# EAGLE design watch_v1_test_Rev01 (EAGLE 9.6.2)
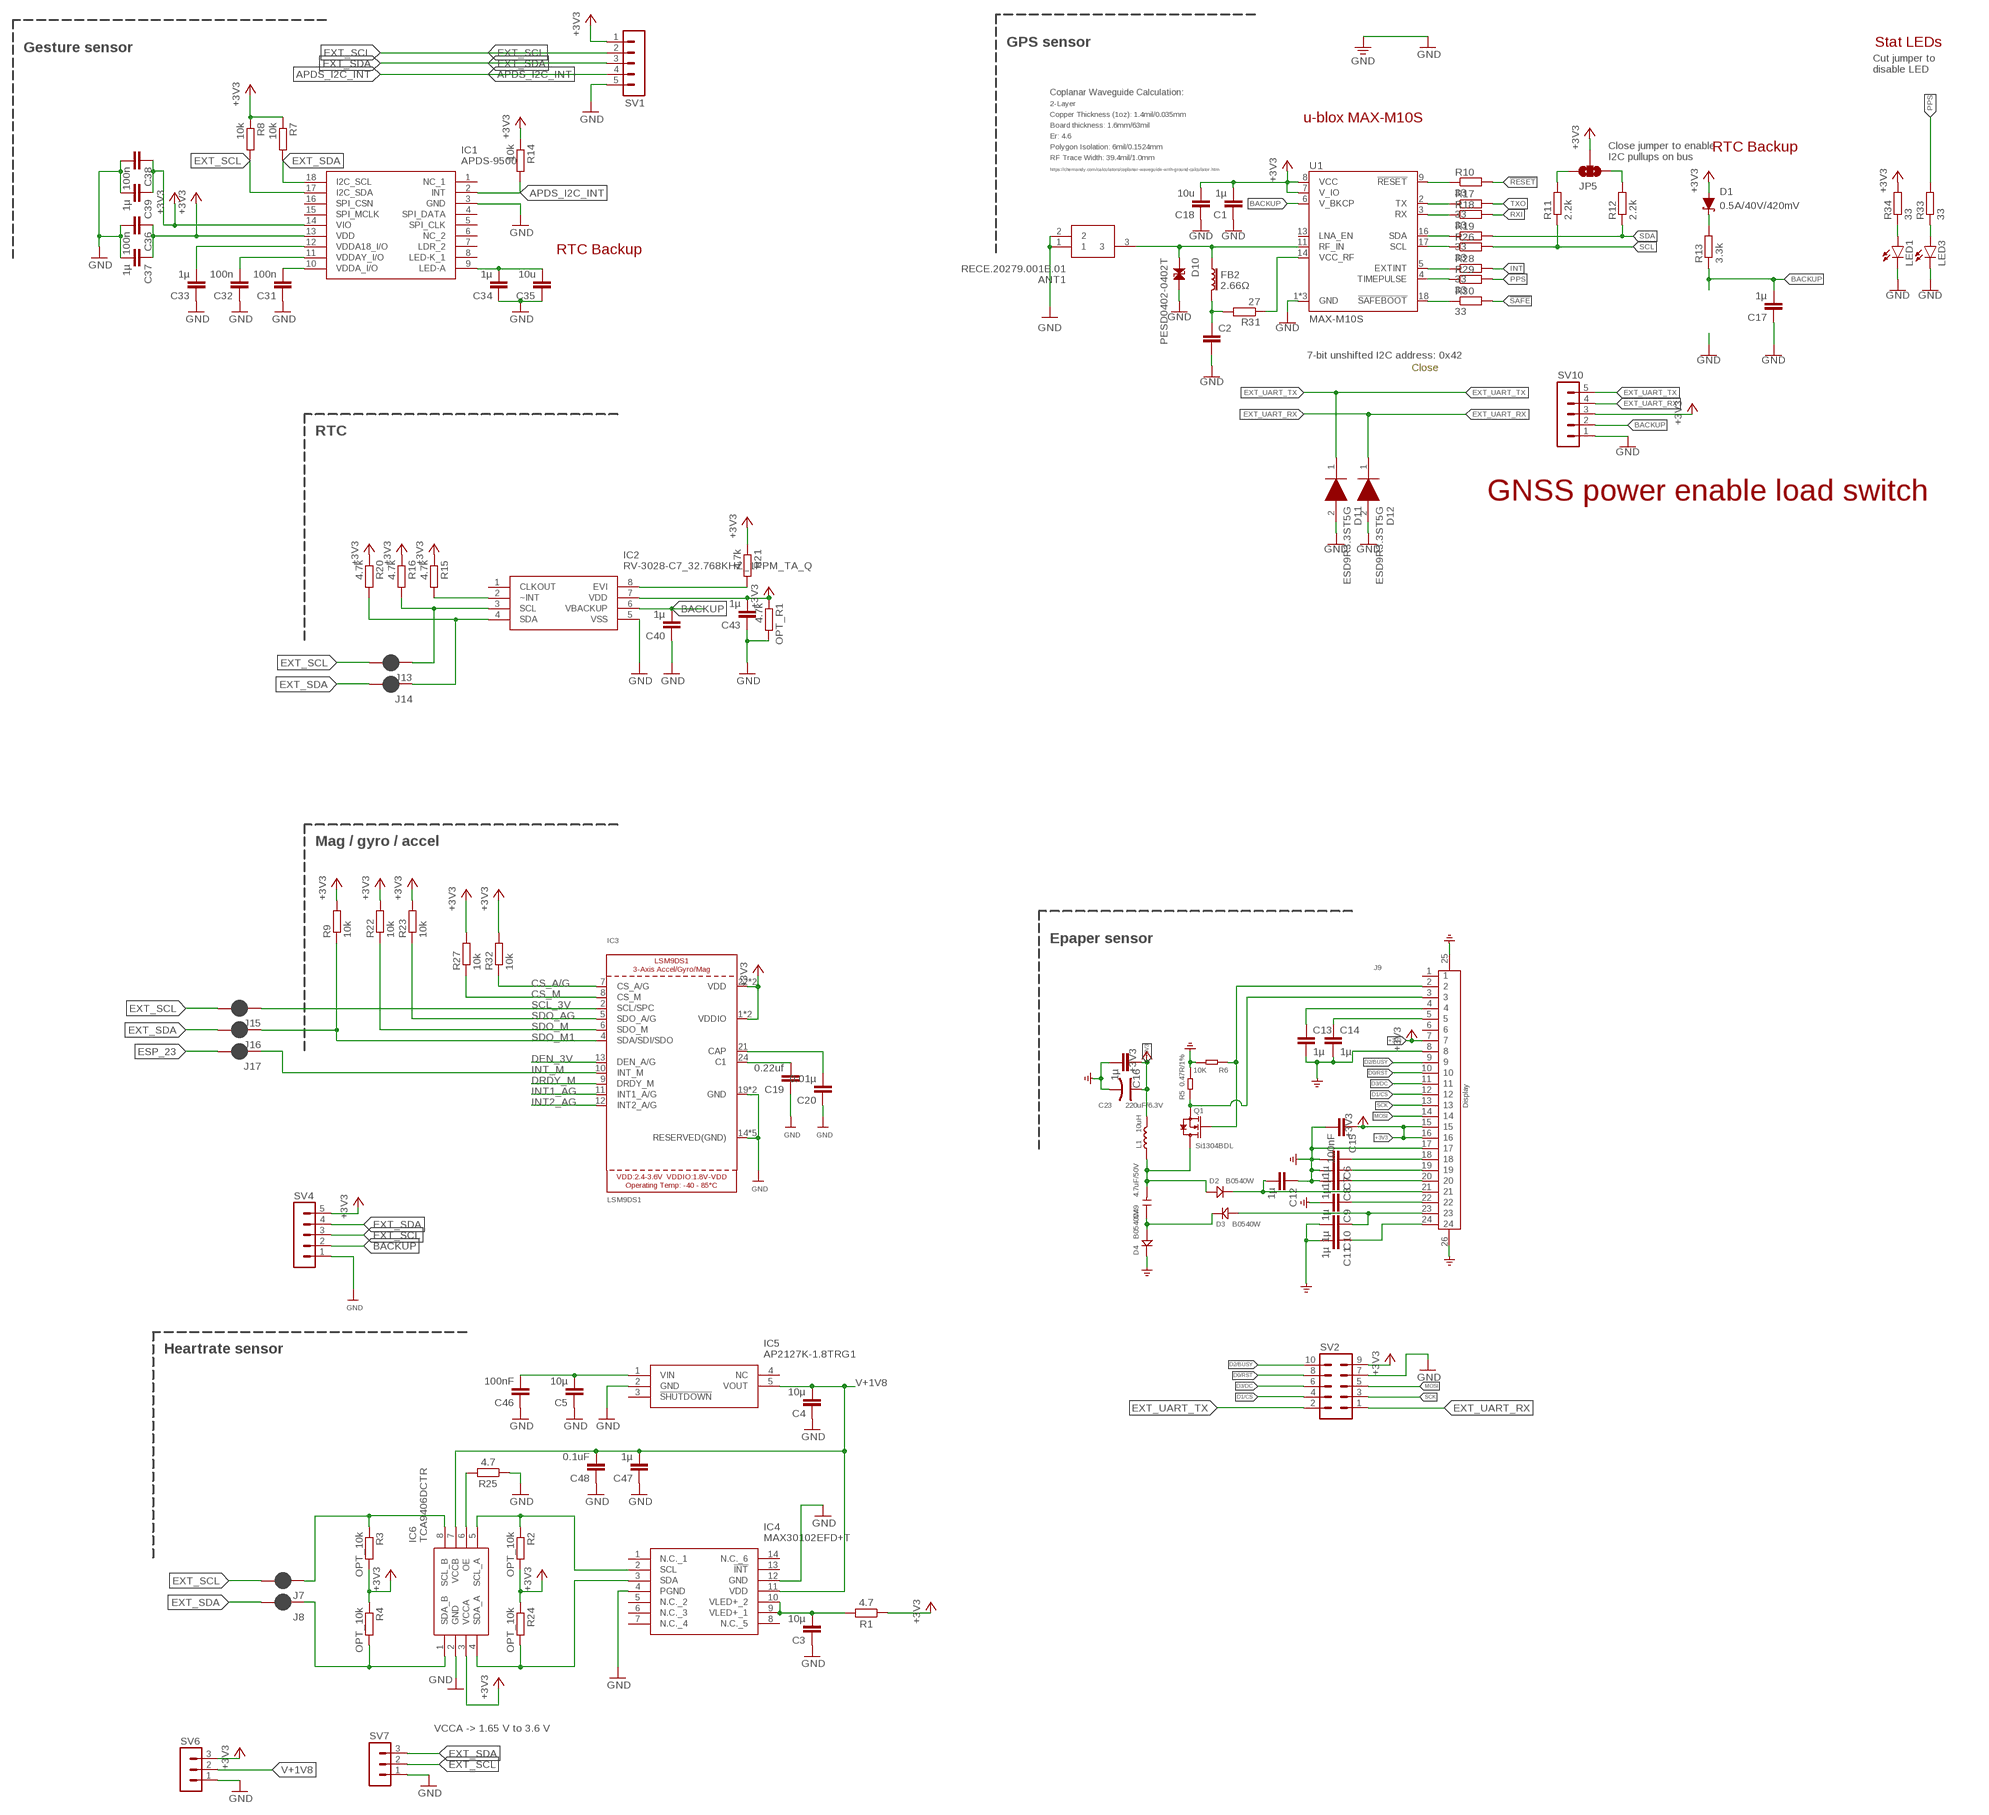
[diagram p0: schematic, sheet 1]

## Parts
ANT1  RECE.20279.001E.01  [RECE.20279.001E.01]
C1  1µ  C0402_S  [C0402_S]
C2  47pF  47PF-0402_TIGHT-25V-5%-X7R  [0402-TIGHT]
C3  10µ  C0402_S  [C0402_S]
C4  10µ  C0402_S  [C0402_S]
C5  10µ  C0402_S  [C0402_S]
C6  1µ  C0402_S  [C0402_S]
C7  1µ  C0402_S  [C0402_S]
C8  1µ  C0402_S  [C0402_S]
C9  1µ  C0402_S  [C0402_S]
C10  1µ  C0402_S  [C0402_S]
C11  1µ  C0402_S  [C0402_S]
C12  1µ  C0402_S  [C0402_S]
C13  1µ  C0402_S  [C0402_S]
C14  1µ  C0402_S  [C0402_S]
C15  100nF  C0402_S  [C0402_S]
C16  1µ  C0402_S  [C0402_S]
C17  1µ  C0402_S  [C0402_S]
C18  10u  C0402_S  [C0402_S]
C19  0.22uf  C0402_S  [C0402_S]
C20  0.01µ  C0402_S  [C0402_S]
C23  220uF/6.3V  CAP-POLAR-AVX-B  [AVX-B]
C31  100n  C0402_S  [C0402_S]
C32  100n  C0402_S  [C0402_S]
C33  1µ  C0402_S  [C0402_S]
C34  1µ  C0402_S  [C0402_S]
C35  10u  C0402_S  [C0402_S]
C36  100n  C0402_S  [C0402_S]
C37  1µ  C0402_S  [C0402_S]
C38  100n  C0402_S  [C0402_S]
C39  1µ  C0402_S  [C0402_S]
C40  1µ  C0402_S  [C0402_S]
C43  1µ  C0402_S  [C0402_S]
C46  100nF  C0402_S  [C0402_S]
C47  1µ  C0402_S  [C0402_S]
C48  0.1uF  C0402_S  [C0402_S]
C49  4.7uF/50V  CAP-1206  [C1206]
D1  0.5A/40V/420mV  DIODE-SCHOTTKY-PMEG4005EJ  [SOD-323]
D2  B0540W  DIODE'0805'  [SOD-323]
D3  B0540W  DIODE'0805'  [SOD-323]
D4  B0540W  DIODE'0805'  [SOD-323]
D10  PESD0402-0402T  [0402-TIGHT]
D11  ESD9R3.3ST5G  [SODFL1006X40N]
D12  ESD9R3.3ST5G  [SODFL1006X40N]
FB2  2.66Ω  FERRITE_BEAD-0402-2.66Ω-1GHZ  [0402-TIGHT]
IC1  APDS-9500  [APDS9500]
IC2  RV-3028-C7_32.768KHZ_1PPM_TA_Q  [RV3028C732768KHZ1PPMTAQC]
IC3  LSM9DS1  [LGA24_3.5X3.1MM]
IC4  MAX30102EFD+T  [MAX30102EFDT]
IC5  AP2127K-1.8TRG1  [SOT95P282X145-5N]
IC6  TCA9406DCTR  [SOP65P400X130-8N]
J7  SMT_JUMPER_2_NC_PASTE  [JUMPER_SMALL]
J8  SMT_JUMPER_2_NC_PASTE  [JUMPER_SMALL]
J9  Display  FPC-CONNECTOR-24P  [FPCB24-SMD-0.5-17.6X5.0X2MM]
J13  SMT_JUMPER_2_NC_PASTE  [JUMPER_SMALL]
J14  SMT_JUMPER_2_NC_PASTE  [JUMPER_SMALL]
J15  SMT_JUMPER_2_NC_PASTE  [JUMPER_SMALL]
J16  SMT_JUMPER_2_NC_PASTE  [JUMPER_SMALL]
J17  SMT_JUMPER_2_NC_PASTE  [JUMPER_SMALL]
JP5  JUMPER-SMT_3_NO_SILK  [SMT-JUMPER_3_NO_SILK]
L1  10uH  INDUCTOR-SPD3D16-4R7M  [L0420]
LED1  LEDSML0603  [SML0603]
LED3  LEDSML0603  [SML0603]
OPT_R1  4.7k  R0402  [R0402]
Q1  Si1304BDL  MOSFET-N'SI1304BDL'  [SOT-323]
R1  4.7  R_CHIP-0603(1608-METRIC)  [RESC1608X60]
R2  OPT_10k  R0402  [R0402]
R3  OPT_10k  R0402  [R0402]
R4  OPT_10k  R0402  [R0402]
R5  0.47R/1%  RES-0603  [R0603]
R6  10K  RES-0603  [R0603]
R7  10k  R0402  [R0402]
R8  10k  R0402  [R0402]
R9  10k  R0402  [R0402]
R10  33  R0402  [R0402]
R11  2.2k  R0402  [R0402]
R12  2.2k  R0402  [R0402]
R13  3.3k  R0402  [R0402]
R14  10k  R0402  [R0402]
R15  4.7k  R0402  [R0402]
R16  4.7k  R0402  [R0402]
R17  33  R0402  [R0402]
R18  33  R0402  [R0402]
R19  33  R0402  [R0402]
R20  4.7k  R0402  [R0402]
R21  4.7k  R0402  [R0402]
R22  10k  R0402  [R0402]
R23  10k  R0402  [R0402]
R24  OPT_10k  R0402  [R0402]
R25  4.7  R_CHIP-0603(1608-METRIC)  [RESC1608X60]
R26  33  R0402  [R0402]
R27  10k  R0402  [R0402]
R28  33  R0402  [R0402]
R29  33  R0402  [R0402]
R30  33  R0402  [R0402]
R31  27  R0402  [R0402]
R32  10k  R0402  [R0402]
R33  33  R0402  [R0402]
R34  33  R0402  [R0402]
SV1  MA05-1  [MA05-1]
SV2  MA05-2  [MA05-2]
SV4  MA05-1  [MA05-1]
SV6  MA03-1  [MA03-1]
SV7  MA03-1  [MA03-1]
SV10  MA05-1  [MA05-1]
U1  MAX-M10S  [MAX-M10S]

## Nets
!RESET: R10.2
!SAFE: R30.2
+3V3: C1.P$2 C15.P$1 C16.P$1 C18.P$2 C23.+ C36.P$1 C37.P$1 C38.P$1 C39.P$1 C43.P$2 D1.A IC1.13(VDD) IC1.14(VIO) IC2.7(VDD) IC3.1(VDDIO) IC3.3(VDDIO) IC3.22(VDD) IC3.23(VDD) IC6.3(VCCA) J9.7 J9.15 J9.16 JP5.2 L1.2 OPT_R1.1 R1.1 R2.2 R3.2 R4.1 R7.1 R8.1 R9.2 R14.1 R15.1 R16.1 R20.1 R21.1 R22.2 R23.2 R24.1 R27.2 R32.2 R34.2 SV1.1 SV2.9 SV4.5 SV6.3 SV10.3 U1.7(V_IO) U1.8(VCC)
ANT_VCC: C2.1 FB2.2 R31.2
APDS_I2C_INT: IC1.2(INT) R14.2 SV1.4
BACKUP: C17.P$2 C40.P$2 IC2.6(VBACKUP) R13.1 SV4.2 SV10.2 U1.6(V_BKCP)
C1: C19.P$2 IC3.24(C1)
CAP: C20.P$2 IC3.21(CAP)
CS_A/G: IC3.7(CS_A/G) R32.1
CS_M: IC3.8(CS_M) R27.1
D0/RST: J9.10 SV2.8
D1/CS: J9.12 SV2.4
D2/BUSY: J9.9 SV2.10
D3/DC: J9.11 SV2.6
DEN_3V: IC3.13(DEN_A/G)
DRDY_M: IC3.9(DRDY_M)
ESP_23: J17.P$2
EXT_SCL: IC1.17(I2C_SDA) J7.P$2 J13.P$2 J15.P$2 R8.2 SV1.2 SV4.3 SV7.2
EXT_SDA: IC1.18(I2C_SCL) J8.P$2 J14.P$2 J16.P$2 R7.2 SV1.3 SV4.4 SV7.3
EXT_UART_RX: D12.1(K) SV2.1 SV10.4
EXT_UART_TX: D11.1(K) SV2.2 SV10.5
EXTINT_LV: R28.1 U1.5(EXTINT)
GDR: J9.2 Q1.1(G) R6.1
GND: ANT1.1 ANT1.2 C1.P$1 C2.2 C3.P$1 C4.P$1 C5.P$1 C6.P$2 C7.P$2 C8.P$2 C9.P$2 C10.P$2 C11.P$2 C12.P$1 C13.P$2 C14.P$2 C15.P$2 C16.P$2 C17.P$1 C18.P$1 C19.P$1 C20.P$1 C23.- C31.P$1 C32.P$1 C33.P$1 C34.P$1 C35.P$1 C36.P$2 C37.P$2 C38.P$2 C39.P$2 C40.P$1 C43.P$1 C46.P$1 C47.P$1 C48.P$1 D4.- D10.2 D11.2(A) D12.2(A) IC1.3(GND) IC2.5(VSS) IC3.14(RESERVED(GND)) IC3.15(RESERVED(GND)) IC3.16(RESERVED(GND)) IC3.17(RESERVED(GND)) IC3.18(RESERVED(GND)) IC3.19(GND) IC3.20(GND) IC4.4(PGND) IC4.12(GND) IC5.2(GND) IC6.2(GND) J9.8 J9.17 J9.25(P1) J9.26(P2) LED1.C LED3.C OPT_R1.2 R5.2 R6.2 R25.1 SV1.5 SV2.7 SV4.1 SV6.1 SV7.1 SV10.1 U1.1(GND) U1.10(GND) U1.12(GND) ; supply symbol labelled GND_POWER
GPS_RF [RF]: ANT1.3 D10.1 FB2.1 U1.11(RF_IN)
INT: R28.2
INT1_AG: IC3.11(INT1_A/G)
INT2_AG: IC3.12(INT2_A/G)
INT_M: IC3.10(INT_M) J17.P$1
MOSI: J9.14 SV2.5
N$1: C5.P$2 C46.P$2 IC5.1(VIN)
N$2: IC4.2(SCL) IC6.5(SCL_A) R2.1
N$3: IC4.3(SDA) IC6.4(SDA_A) R24.2
N$4: C31.P$2 IC1.10(VDDA_I/O)
N$5: IC6.8(SCL_B) J7.P$1 R3.1
N$6: IC6.1(SDA_B) J8.P$1 R4.2
N$7: LED3.A R33.1
N$8: C32.P$2 IC1.11(VDDAY_I/O)
N$9: C33.P$2 IC1.12(VDDA18_I/O)
N$10: C34.P$2 C35.P$2 IC1.9(LED-A)
N$12: LED1.A R34.1
N$14: IC2.4(SDA) J14.P$1 R20.2
N$15: C3.P$2 IC4.9(VLED+_1) IC4.10(VLED+_2) R1.2
N$16: IC2.3(SCL) J13.P$1 R16.2
N$17: IC2.2(~INT) R15.2
N$19: JP5.1 R12.2
N$20: JP5.3 R11.2
N$21: D1.C R13.2
N$23: C6.P$1 J9.18
N$26: C7.P$1 J9.19
N$27: C8.P$1 J9.20
N$44: IC6.6(OE) R25.2
N$45: IC2.8(EVI) R21.2
N$46: C12.P$2 D2.- J9.21
N$47: C9.P$1 J9.22
N$48: C10.P$1 D3.+ J9.23
N$49: C49.1 D3.- D4.+
N$50: C49.2 D2.+ L1.1 Q1.3(D)
N$51: C13.P$1 J9.4
PPS: R29.2 R33.2
PPS_LV: R29.1 U1.4(TIMEPULSE)
RESE: J9.3 Q1.2(S) R5.1
RST_LV: R10.1 U1.9(!RESET!)
RXI: R18.2
RXLV: R18.1 U1.3(RX)
SAFE_LV: R30.1 U1.18(!SAFEBOOT!)
SCK: J9.13 SV2.3
SCL: R11.1 R26.2
SCL_3V: IC3.2(SCL/SPC) J15.P$1
SCL_LV: R26.1 U1.17(SCL)
SDA: R12.1 R19.2
SDA_LV: R19.1 U1.16(SDA)
SDO_AG: IC3.5(SDO_A/G) R23.1
SDO_M: IC3.6(SDO_M) R22.1
SDO_M1: IC3.4(SDA/SDI/SDO) J16.P$1 R9.1
TXLV: R17.1 U1.2(TX)
TXO: R17.2
V+1V8: C4.P$2 C47.P$2 C48.P$2 IC4.11(VDD) IC5.5(VOUT) IC6.7(VCCB) SV6.2
VCC_RF: R31.1 U1.14(VCC_RF)
VCOM: C11.P$1 J9.24
VGH: C14.P$1 J9.5
Unconnected: IC1.1(NC_1) IC1.4(SPI_DATA) IC1.5(SPI_CLK) IC1.6(NC_2) IC1.7(LDR_2) IC1.8(LED-K_1) IC1.15(SPI_MCLK) IC1.16(SPI_CSN) IC2.1(CLKOUT) IC4.1(N.C._1) IC4.5(N.C._2) IC4.6(N.C._3) IC4.7(N.C._4) IC4.8(N.C._5) IC4.13(!INT) IC4.14(N.C._6) IC5.3(!SHUTDOWN) IC5.4(NC) J9.1 J9.6 U1.13(LNA_EN)

## Notes on the sheet
- Stat LEDs
- GPS sensor
- Gesture sensor
- Cut jumper to 
  disable LED
- Coplanar Waveguide Calculation:
- 2-Layer
- Copper Thickness (1oz): 1.4mil/0.035mm | u-blox MAX-M10S
- Board thickness: 1.6mm/63mil
- Er: 4.6
- RTC Backup
- Polygon Isolation: 6mil/0.1524mm
- RF Trace Width: 39.4mil/1.0mm
- Close jumper to enable
  I2C pullups on bus
- https://chemandy.com/calculators/coplanar-waveguide-with-ground-calculator.htm
- RTC Backup
- 7-bit unshifted I2C address: 0x42
- Close
- RTC
- GNSS power enable load switch
- Mag / gyro / accel
- Epaper sensor
- Heartrate sensor
- VCCA -> 1.65 V to 3.6 V

## Library data of the parts
ANT1 = RECE.20279.001E.01:RECE.20279.001E.01: IPEX MHF Receptacle Source: Datasheet <https://datasheet.datasheetarchive.com/originals/distributors/Datasheets-DGA15/760324.pdf>; DESCRIPTION: IPEX MHF Receptacle; HEIGHT: mm; MANUFACTURER_NAME: Taoglas; MANUFACTURER_PART_NUMBER: RECE.20279.001E.01; MOUSER_PART_NUMBER: 960-RECE20279001E01; MOUSER_PRICE-STOCK: https://www.mouser.co.uk/ProductDetail/Taoglas/RECE.20279.001E.01?qs=MyNHzdoqoQIdppWb9vcEBA%3D%3D
C1 C3-C20 C31-C40 C43 C46-C48 = moekoe_rcl:C0402
C2 = SparkFun-Capacitors:47PF: 47pF ceramic capacitors A capacitor is a passive two-terminal electrical component used to store electrical energy temporarily in an electric field.; PROD_ID: CAP-15063
C23 = Discrete-new:CAP-POLAR: Electrolytic Capacitors,Tantalum Capacitors and Super Capacitors
C49 = Discrete-new:CAP: Ceramic Capacitors
D1 = SparkFun-DiscreteSemi:DIODE-SCHOTTKY: Schottky diode A Schottky diode is a semiconductor diode which has a low forward voltage drop and a very fast switching action.; PROD_ID: DIO-10955
D2-D4 = Discrete-new:DIODE*
D10 = SparkFun-DiscreteSemi:PESD0402: ESD protection diode PESD is used to protect a signal line from ESD.; PROD_ID: DIO-15359
D11 D12 = Myriota_SOH_lib:ESD9R3.3ST5G: Transient Voltage Suppressors ESD Protection Diodes with UltraLow Leakage Source: Datasheet <http://www.onsemi.com/pub/Collateral/ESD9R3.3S-D.PDF>; DESCRIPTION: Transient Voltage Suppressors ESD Protection Diodes with UltraLow Leakage; HEIGHT: 0.4mm; MANUFACTURER_NAME: ON Semiconductor; MANUFACTURER_PART_NUMBER: ESD9R3.3ST5G; MOUSER_PART_NUMBER: 863-ESD9R3.3ST5G; MOUSER_PRICE-STOCK: https://www.mouser.co.uk/ProductDetail/ON-Semiconductor/ESD9R33ST5G?qs=N5dOQkml4H9504itvxWhoA%3D%3D
FB2 = SparkFun-Coils:FERRITE_BEAD: Ferrite Bead (blocks, cores, rings, chokes, etc.) Inductor with layers of ferrite used to suppress high frequencies. Often used to isolate high frequency noise. SparkFun Products: IOIO-OTG - V2.2 <https://www.sparkfun.com/products/13613> SparkFun SAMD21 Mini Breakout <https://www.sparkfun.com/products/13664> SparkFun 6 Degrees of Freedom Breakout - LSM6DS3 <https://www.sparkfun.com/products/13339> SparkFun SAMD21 Dev Breakout <https://www.sparkfun.com/products/13672>; PROD_ID: NDUC-15072
IC1 = APDS-9500:APDS-9500: Proximity Sensors Imaging Gesture and Proximity Sensor Source: Datasheet <https://docs.broadcom.com/doc/AV02-4584EN>; DESCRIPTION: Proximity Sensors Imaging Gesture and Proximity Sensor; HEIGHT: 2.93mm; MANUFACTURER_NAME: Avago Technologies; MANUFACTURER_PART_NUMBER: APDS-9500; MOUSER_PART_NUMBER: 630-APDS-9500; MOUSER_PRICE-STOCK: https://www.mouser.co.uk/ProductDetail/Broadcom-Avago/APDS-9500?qs=JUmsgfbaopQe1NLOYUFMlg%3D%3D
IC2 = RV-3028-C7_32.768kHz_1ppm_TA_Q:RV-3028-C7_32.768KHZ_1PPM_TA_Q: Real Time Clock 32.768kHz I2C Time Acc. 1ppm Source: Datasheet <https://www.mouser.de/datasheet/2/530/RV_3028_C7-1524919.pdf>; DESCRIPTION: Real Time Clock 32.768kHz I2C Time Acc. 1ppm; HEIGHT: 0.8mm; MANUFACTURER_NAME: Micro Crystal AG; MANUFACTURER_PART_NUMBER: RV-3028-C7 32.768kHz 1ppm TA QC; MOUSER_PART_NUMBER: 428-203591-MG01; MOUSER_PRICE-STOCK: https://www.mouser.co.uk/ProductDetail/Micro-Crystal/RV-3028-C7-32.768kHz-1ppm-TA-QC?qs=u16ybLDytRaU7ZFJl2AxfQ%3D%3D
IC3 = microbuilder:LSM9DS1
IC4 = MAX30102EFD+T:MAX30102EFD+T: Biometric Sensors Integrated Optical Sensor Source: Datasheet <https://www.analog.com/media/en/technical-documentation/data-sheets/MAX30102.pdf>; DESCRIPTION: Biometric Sensors Integrated Optical Sensor; HEIGHT: 1.65mm; MANUFACTURER_NAME: Analog Devices; MANUFACTURER_PART_NUMBER: MAX30102EFD+T; MOUSER_PART_NUMBER: 700-MAX30102EFD+T; MOUSER_PRICE-STOCK: https://www.mouser.co.uk/ProductDetail/Analog-Devices-Maxim-Integrated/MAX30102EFD%2bT?qs=nVS1qgv%252BQrkHA4%2FoFYriFA%3D%3D
IC5 = AP2127K-1.8TRG1:AP2127K-1.8TRG1: Linear Voltage Regulator IC Positive Fixed 1 Output 300mA SOT-23-5 Source: Datasheet <https://www.diodes.com//assets/Datasheets/AP2127.pdf>; DESCRIPTION: Linear Voltage Regulator IC Positive Fixed 1 Output 300mA SOT-23-5; HEIGHT: 1.45mm; MANUFACTURER_NAME: Diodes Incorporated; MANUFACTURER_PART_NUMBER: AP2127K-1.8TRG1; MOUSER_PART_NUMBER: 621-AP2127K-1.8TRG1; MOUSER_PRICE-STOCK: https://www.mouser.co.uk/ProductDetail/Diodes-Incorporated/AP2127K-1.8TRG1?qs=x6A8l6qLYDDmU4WXw4%252BBlA%3D%3D
IC6 = TCA9406DCTR:TCA9406DCTR: 2-Bit Bidirectional 1-MHz I2C Bus and SMBus Voltage-Level Shifter Source: Datasheet <http://www.ti.com/lit/ds/symlink/tca9406.pdf>; DESCRIPTION: 2-Bit Bidirectional 1-MHz I2C Bus and SMBus Voltage-Level Shifter; HEIGHT: 1.3mm; MANUFACTURER_NAME: Texas Instruments; MANUFACTURER_PART_NUMBER: TCA9406DCTR; MOUSER_PART_NUMBER: 595-TCA9406DCTR; MOUSER_PRICE-STOCK: https://www.mouser.co.uk/ProductDetail/Texas-Instruments/TCA9406DCTR?qs=Ze4%2FuFuz19L6Yntu0RTUyw%3D%3D
J7 J8 J13-J17 = moekoe_pads_jumpers:SMT_JUMPER_2_NC_PASTE
J9 = Connector-new:FPC-CONNECTOR-24P
JP5 = SparkFun-Jumpers:JUMPER-SMT_3_NO: Normally open jumper This jumper has three pads in close proximity to each other. Apply solder to close the connection(s).
L1 = Discrete-new:INDUCTOR
LED1 LED3 = led:LED: LED OSRAM: - CHIPLED LG R971, LG N971, LY N971, LG Q971, LY Q971, LO R971, LY R971 LH N974, LH R974 LS Q976, LO Q976, LY Q976 LO Q996 - Hyper CHIPLED LW Q18S LB Q993, LB Q99A, LB R99A - SideLED LS A670, LO A670, LY A670, LG A670, LP A670 LB A673, LV A673, LT A673, LW A673 LH A674 LY A675 LS A676, LA A676, LO A676, LY A676, LW A676 LS A679, LY A679, LG A679 - Hyper Micro SIDELED® LS Y876, LA Y876, LO Y876, LY Y876 LT Y87S - SmartLED LW L88C, LW L88S LB L89C, LB L89S, LG L890 LS L89K, LO L89K, LY L89K LS L896, LA L896, LO L896, LY L896 - TOPLED LS T670, LO T670, LY T670, LG T670, LP T670 LSG T670, LSP T670, LSY T670, LOP T670, LYG T670 LG T671, LOG T671, LSG T671 LB T673, LV T673, LT T673, LW T673 LH T674 LS T676, LA T676, LO T676, LY T676, LB T676, LH T676, LSB T676, LW T676 LB T67C, LV T67C, LT T67C, LS T67K, LO T67K, LY T67K, LW E67C LS E67B, LA E67B, LO E67B, LY E67B, LB E67C, LV E67C, LT E67C LW T67C LS T679, LY T679, LG T679 LS T770, LO T770, LY T770, LG T770, LP T770 LB T773, LV T773, LT T773, LW T773 LH T774 LS E675, LA E675, LY E675, LS T675 LS T776, LA T776, LO T776, LY T776, LB T776 LHGB T686 LT T68C, LB T68C - Hyper Mini TOPLED® LB M676 - Mini TOPLED Santana® LG M470 LS M47K, LO M47K, LY M47K Source: http://www.osram.convergy.de LUXEON: - LUMILED® LXK2-PW12-R00, LXK2-PW12-S00, LXK2-PW14-U00, LXK2-PW14-V00 LXK2-PM12-R00, LXK2-PM12-S00, LXK2-PM14-U00 LXK2-PE12-Q00, LXK2-PE12-R00, LXK2-PE12-S00, LXK2-PE14-T00, LXK2-PE14-U00 LXK2-PB12-K00, LXK2-PB12-L00, LXK2-PB12-M00, LXK2-PB14-N00, LXK2-PB14-P00, LXK2-PB14-Q00 LXK2-PR12-L00, LXK2-PR12-M00, LXK2-PR14-Q00, LXK2-PR14-R00 LXK2-PD12-Q00, LXK2-PD12-R00, LXK2-PD12-S00 LXK2-PH12-R00, LXK2-PH12-S00 LXK2-PL12-P00, LXK2-PL12-Q00, LXK2-PL12-R00 Source: www.luxeon.com KINGBRIGHT: KA-3528ASYC Source: www.kingbright.com; CATEGORY: LED; MANUFACTURER: Wurth Elektronik; MOUNT_TYPE: SMT; MPN: 150060GS84000; PACKAGE-CASE: 0603; PRICE_AUD_SINGLE: 0.594; VENDOR: Mouser; VENDOR_NUMBER: 710-150060GS84000
OPT_R1 R2-R4 R7-R24 R26-R34 = moekoe_rcl:R0402
Q1 = Discrete-new:MOSFET-N: IRLL014: http://www.vishay.com/docs/91319/sihll014.pdf
R1 R25 = Resistor:R: Resistor Fixed - Generic; CATEGORY: Resistor; SUB-CATEGORY: Fixed
R5 R6 = Discrete-new:RES
SV1 SV4 SV10 = con-lstb:MA05-1: PIN HEADER; OC_FARNELL: unknown; OC_NEWARK: unknown
SV2 = con-lstb:MA05-2: PIN HEADER; OC_FARNELL: unknown; OC_NEWARK: unknown
SV6 SV7 = con-lstb:MA03-1: PIN HEADER; OC_FARNELL: unknown; OC_NEWARK: unknown
U1 = GNSS-MAX:MAX-M10S; PROD_ID: IC-15926

## Net classes
1 PWR IN: width 0.203 mm
2 3.3V: width 0.508 mm, drill 0.305 mm
3 RF: width 0.889 mm, drill 0.305 mm, clearance 0.203 mm

## Board
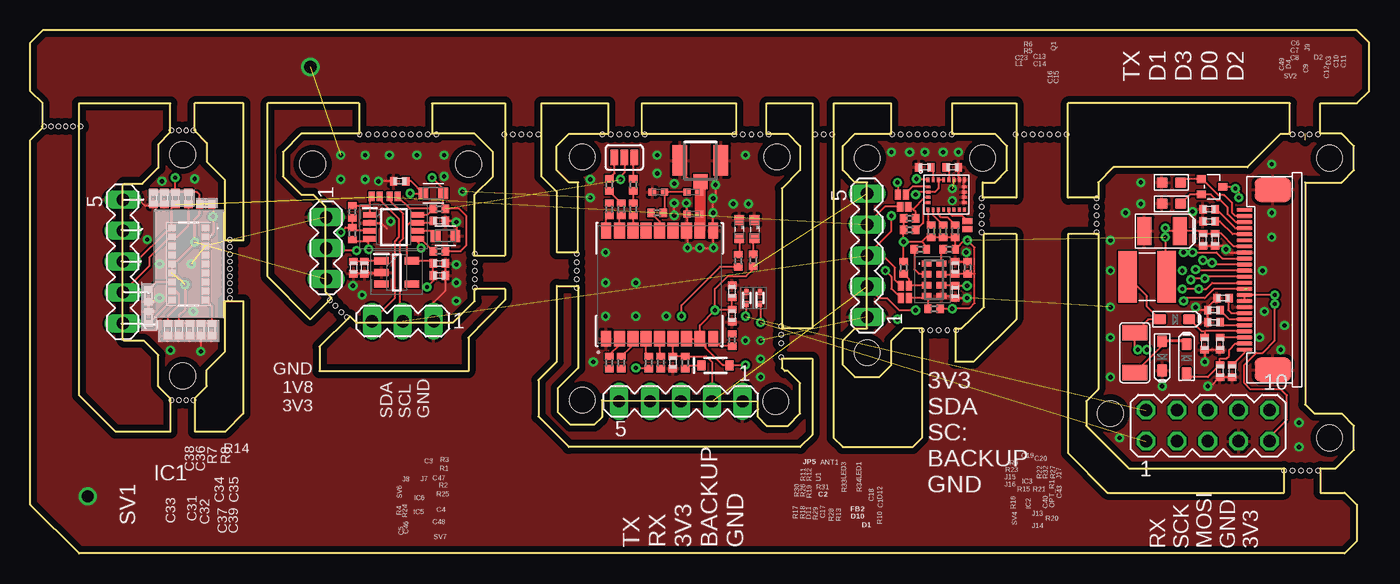
[diagram p1: board, top side]
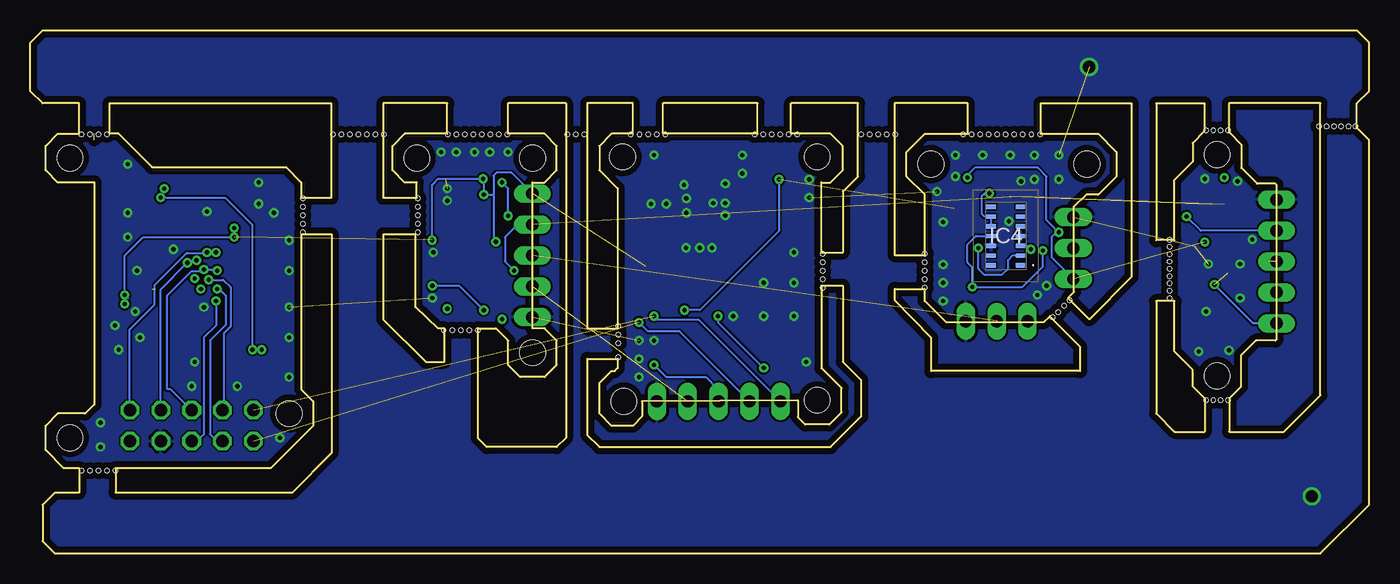
[diagram p2: board, bottom side, seen from below]

Size 110 x 43 mm. Coordinates in mm from the lower left corner, seen from the top.
Outline: 104.75,34 104.75,34.5
Outline: 104.75,30.5 104.75,12.25 105.5,11.5 107.75,11.5 108.75,10.5 108.75,8.5 107.25,7 106,7 106,5 108,5 109,4 109,1 108,0 4,0 0,4 0,34 1,35 1,37 0,38 0,42 1,43 109,43 110,42 110,38 109,37 106,37 106,34.5 107.75,34.5 108.75,33.5 108.75,31.5 107.75,30.5 104.75,30.5
Outline: 87.75,30.5 87.75,29.25 85.25,29.25 85.25,37 103.5,37 103.5,34.5 102.75,34.5 100,31.75 89,31.75 87.75,30.5
Outline: 87.75,26.25 87.75,13.5 86.75,12.5 86.75,10.5 90.25,7 103,7 103,5 88.5,5 85.25,8.25 85.25,26.25 87.75,26.25
Outline: 67.75,34.5 70.75,34.5 70.75,37 66,37 66,9.5 66.75,8.75 72.5,8.75 73.25,9.5 73.25,18.5 71.75,18.5 70.75,17.5 70.75,15.5 69.75,14.5 67.75,14.5 66.75,15.5 66.75,17.5 67.75,18.5 68.75,18.5 68.75,30.5 67.75,30.5 66.75,31.5 66.75,33.5 67.75,34.5
Outline: 75.75,34.5 79.25,34.5 80.25,33.5 80.25,31.5 79.25,30.5 78.25,30.5 78.25,29.25 81,29.25 81,37 75.75,37 75.75,34.5
Outline: 78.35,20.25 78.35,26.25 81,26.25 81,19.25 77.5,15.75 76,15.75 76,18.5 76.5,18.5 78.35,20.25
Outline: 44.35,10.6 46.35,10.6 46.95,11.2 46.95,12.6 59.75,12.5 59.75,11.25 60.5,10.5 62.25,10.5 63.25,11.5 63.25,14 62.25,15 62,15 61.75,15.25 61.75,16 64.25,16 64.25,9.75 63.25,8.75 44.25,8.75 41.75,11.25 41.75,14.25 43.25,15.75 43.25,22 45,22 45,15.25 43.35,13.6 43.35,11.6 44.35,10.6
Outline: 36.5,29.5 38,31 38,33 36.5,34.5 33,34.5 33,37 39,37 39,24.5 36.5,24.5 36.5,29.5
Outline: 20.75,33 20.75,31 22.25,29.5 23.25,29.5 24.25,28.5 24.25,21.5 24.75,21 23,19.25 19.5,22.75 19.5,37 27,37 27,34.5 22.25,34.5 20.75,33
Outline: 26.75,19 34.75,19 36.5,20.75 36.5,21.75 39,21.75 39,20.85 36,17.75 36,15 23.75,15 23.75,17 26.25,19.5 26.75,19
Outline: 42,31 42,37 47.5,37 47.5,34.5 44.25,34.5 43.25,33.5 43.25,31.5 44.25,30.5 45,30.5 45,24.75 43.25,24.75 43.25,29.75 42,31
Outline: 50.25,37 58,37 58,34.5 50.25,34.5 50.25,37
Outline: 60.5,37 64.25,37 64.25,18.5 61.75,18.5 61.75,30 63.25,31.5 63.25,33.5 62.25,34.5 60.5,34.5 60.5,37
Outline: 14.5,13.75 14.5,15.1 16,16.6 16,20.75 17.5,20.75 17.5,11.5 16,10 13.5,10 13.5,12.75 14.5,13.75
Outline: 14.5,33.75 14.5,32.2 16,30.7 16,25.75 17.5,25.75 17.5,37 13.5,37 13.5,34.75 14.5,33.75
Outline: 10.5,13.75 10.5,16.3 9.3,17.5 7.7,17.5 7.6,17.6 7.6,30.3 7.7,30.4 9.2,30.4 10.5,31.7 10.5,33.62 11.5,34.62 11.5,37 4,37 4,13 7,10 11.5,10 11.5,12.75 10.5,13.75
Copper layers (1*16): Top 0.035mm / dielectric 1.5mm / Bottom 0.035mm
Design rules "default *": minimum track width 6mil, minimum drill 0.35mm, track to track 6mil, track to pad 6mil, pad to pad 6mil, via to via 6mil, smd to smd 6mil, copper to edge 20mil, drill to drill 6mil, minimum pad ring 10mil, minimum via ring 8mil, stop-mask expansion 4mil, vias tented up to drill 0.4mm, thermal gap 10mil
Holes 2.1 mm at 106.75,32.5 88.75,11.5 78.25,32.5 68.75,16.5 68.75,32.5 45.35,12.6 61.35,32.6 45.35,32.6 106.75,9.5 23.2,32 61.25,12.5 36,32 12.5,14.6 12.5,32.8
Holes 0.35 mm at 70.8,34.45 71.5,34.45 72.2,34.45 72.9,34.45 73.6,34.45 74.3,34.45 75,34.45 75.7,34.45 78.15,29.2 78.15,28.5 78.15,27.8 78.15,27.1 78.15,26.4 87.6,26.4 87.6,27.1 87.6,27.8 87.6,28.5 87.6,29.2 103.7,34.45 104.4,34.45 105.1,34.45 105.8,34.45 103,6.8 103.7,6.8 104.4,6.8 105.1,6.8 105.8,6.8 61.7,16.15 61.7,17.3 61.7,18 61.7,18.7 73.25,18.35 73.95,18.35 74.65,18.35 75.35,18.35 76.05,18.35 44.9,21.85 44.9,22.55 44.9,23.25 44.9,23.95 44.9,24.65 36.5,21.85 36.5,22.55 36.5,23.25 36.5,23.95 36.5,24.65 24.6,20.8 25.05,20.35 25.55,19.85 26,19.4 27.05,34.45 27.75,34.45 28.45,34.45 29.15,34.45 29.85,34.45 30.55,34.45 31.25,34.45 31.95,34.45 32.65,34.45 60.65,34.45 59.95,34.45 59.25,34.45 58.55,34.45 57.85,34.45 50.5,34.45 49.8,34.45 49.1,34.45 48.4,34.45 47.7,34.45 47,34.45 33.35,34.45 38.95,34.45 39.65,34.45 40.35,34.45 41.05,34.45 41.75,34.45 65.9,34.45 65.2,34.45 64.5,34.45 80.95,34.45 81.65,34.45 82.35,34.45 83.05,34.45 83.75,34.45 84.45,34.45 85.15,34.45 11.6,12.6 12.2,12.6 12.8,12.6 13.4,12.6 11.6,34.8 12.2,34.8 12.8,34.8 13.4,34.8 1.1,35.1 1.7,35.1 2.3,35.1 2.9,35.1 3.5,35.1 4.1,35.1 16.4,22.2 16.4,22.8 16.4,23.4 16.4,24 16.4,24.6 16.4,25.2 16.4,25.8 16.4,21.6 16.4,21

### Footprints (pad centres in the part's own frame; a part is rotated, then mirrored left to right if it is on the bottom)
RECE.20279.001E.01 = smd 1.2 x 2.5: 1 -1.685,0; 2 1.685,0 | smd 1.15 x 1.2: 3 0,-1.73
C0402_S = smd 0.6 x 0.7: P$1 -0.5,0; P$2 0.5,0
0402-TIGHT = smd 0.6 x 0.6: 1 -0.5,0; 2 0.5,0
AVX-B = smd 1.143 x 2.286: + 1.46,0; - -1.46,0
C1206 = smd 1.27 x 2.032: 1 -1.651,0; 2 1.651,0
SOD-323 = smd 0.63 x 0.83: A 1.15,0; C -1.15,0
SOD-323' = smd 1 x 0.8: + 1.2,0; - -1.2,0
SODFL1006X40N = smd 0.51 x 0.32: 1 -0.5,0; 2 0.5,0
APDS9500 = smd 0.6 x 0.55: 1 1.377,2.96; 2 1.377,2.22; 3 1.377,1.48; 4 1.377,0.74; 5 1.377,0; 6 1.377,-0.74; 7 1.377,-1.48; 8 1.377,-2.22; 9 1.377,-2.96; 10 -1.377,-2.96; 11 -1.377,-2.22; 12 -1.377,-1.48; 13 -1.377,-0.74; 14 -1.377,0; 15 -1.377,0.74; 16 -1.377,1.48; 17 -1.377,2.22; 18 -1.377,2.96
RV3028C732768KHZ1PPMTAQC = smd 0.5 x 0.8: 1 -1.35,-0.6; 2 -0.45,-0.6; 3 0.45,-0.6; 4 1.35,-0.6; 5 1.35,0.6; 6 0.45,0.6; 7 -0.45,0.6; 8 -1.35,0.6
LGA24_3.5X3.1MM = smd 0.23 x 0.35: 1 -1.505,1.22; 6 -1.505,-1.22; 7 -1.075,-1.22; 8 -0.645,-1.22; 9 -0.215,-1.22; 10 0.215,-1.22; 11 0.645,-1.22; 12 1.075,-1.22; 13 1.505,-1.22; 18 1.505,1.22; 19 1.075,1.22; 20 0.645,1.22; 21 0.215,1.22; 22 -0.215,1.22; 23 -0.645,1.22; 24 -1.075,1.22 | smd 0.35 x 0.23: 2 -1.475,0.645; 3 -1.475,0.215; 4 -1.475,-0.215; 5 -1.475,-0.645; 14 1.475,-0.645; 15 1.475,-0.215; 16 1.475,0.215; 17 1.475,0.645
MAX30102EFDT = smd 0.75 x 0.35: 1 -1.2,2.4; 2 -1.2,1.6; 3 -1.2,0.8; 4 -1.2,0; 5 -1.2,-0.8; 6 -1.2,-1.6; 7 -1.2,-2.4; 8 1.2,-2.4; 9 1.2,-1.6; 10 1.2,-0.8; 11 1.2,0; 12 1.2,0.8; 13 1.2,1.6; 14 1.2,2.4
SOT95P282X145-5N = smd 1.2 x 0.6: 1 -1.25,0.95; 2 -1.25,0; 3 -1.25,-0.95; 4 1.25,-0.95; 5 1.25,0.95
SOP65P400X130-8N = smd 1.1 x 0.45: 1 -1.95,0.975; 2 -1.95,0.325; 3 -1.95,-0.325; 4 -1.95,-0.975; 5 1.95,-0.975; 6 1.95,-0.325; 7 1.95,0.325; 8 1.95,0.975
JUMPER_SMALL = smd 0.5 x 0.8: P$1 -0.33,0; P$2 0.33,0
FPCB24-SMD-0.5-17.6X5.0X2MM = smd 0.3 x 1.3: 1 5.75,0; 2 5.25,0; 3 4.75,0; 4 4.25,0; 5 3.75,0; 6 3.25,0; 7 2.75,0; 8 2.25,0; 9 1.75,0; 10 1.25,0; 11 0.75,0; 12 0.25,0; 13 -0.25,0; 14 -0.75,0; 15 -1.25,0; 16 -1.75,0; 17 -2.25,0; 18 -2.75,0; 19 -3.25,0; 20 -3.75,0; 21 -4.25,0; 22 -4.75,0; 23 -5.25,0; 24 -5.75,0 | smd 2 x 3: 25 -7.4,-2.35; 26 7.4,-2.35
SMT-JUMPER_3_NO_SILK = smd 0.635 x 1.27: 1 -0.813,0; 2 0,0; 3 0.813,0
L0420 = smd 1.5 x 4.2: 1 -1.6,0; 2 1.6,0
SML0603 = smd 0.8 x 0.8: A 0.75,0; C -0.75,0
R0402 = smd 0.6 x 0.7: 1 -0.5,0; 2 0.5,0
SOT-323 = smd 0.762 x 0.635: 1 0.889,-0.635; 2 0.889,0.635; 3 -0.889,0
RESC1608X60 = smd 0.799 x 0.974: 1 -0.815,0; 2 0.815,0
R0603 = smd 0.889 x 0.889: 1 -0.762,0; 2 0.762,0
MA05-1 = drill 1.016 long: 1 -5.08,0; 2 -2.54,0; 3 0,0; 4 2.54,0; 5 5.08,0
MA05-2 = drill 1.016 octagon: 1 -5.08,-1.27; 2 -5.08,1.27; 3 -2.54,-1.27; 4 -2.54,1.27; 5 0,-1.27; 6 0,1.27; 7 2.54,-1.27; 8 2.54,1.27; 9 5.08,-1.27; 10 5.08,1.27
MA03-1 = drill 1.016 long: 1 -2.54,0; 2 0,0; 3 2.54,0
MAX-M10S = smd 1.3 x 0.8: 1 4.45,-4.4; 9 4.45,4.4; 10 -4.45,4.4; 18 -4.45,-4.4 | smd 1.3 x 0.9: 2 4.45,-3.3; 3 4.45,-2.2; 4 4.45,-1.1; 5 4.45,0; 6 4.45,1.1; 7 4.45,2.2; 8 4.45,3.3; 11 -4.45,3.3; 12 -4.45,2.2; 13 -4.45,1.1; 14 -4.45,0; 15 -4.45,-1.1; 16 -4.45,-2.2; 17 -4.45,-3.3

### Placement (x,y rotation side)
ANT1  55.05,32.3 0 top
C1  57.65,19.55 90 top
C2  51.6,29.7 180 top
C3  30.35,30.6 0 top
C4  33.6,23.85 180 top
C5  26.55,23.5 90 top
C6  98,21 180 top
C7  97.25,20 180 top
C8  97.25,19 180 top
C9  97.75,17.25 270 top
C10  97.75,15 270 top
C11  98.75,15 270 top
C12  96.5,17.25 90 top
C13  96.85,28.3 180 top
C14  96.85,27.3 180 top
C15  97.35,25.8 270 top
C16  96.35,25.8 270 top
C17  52.8,15.7 90 top
C18  57.65,21.55 270 top
C19  73.5,31.75 0 top
C20  75.75,31.75 180 top
C23  93,26.5 0 top
C31  9.7,19.4 270 top
C32  11.3,18.4 90 top
C33  9.7,21.2 90 top
C34  14,18.4 90 top
C35  14.9,18.4 90 top
C36  11,29.2 270 top
C37  12.2,18.4 270 top
C38  10.1,29.2 270 top
C39  13.1,18.4 270 top
C40  76,21.5 90 top
C43  76,23.5 270 top
C46  27.45,23.5 90 top
C47  33.6,27.35 180 top
C48  33.6,22.85 180 top
C49  90.75,16.5 90 top
D1  56.3,15.45 0 top
D2  B0540W  [SOD-323']  94,19.25 180 top
D3  B0540W  [SOD-323']  95,16 270 top
D4  B0540W  [SOD-323']  93,16.25 90 top
D10  54.45,27.9 180 top
D11  58.85,21 90 top
D12  59.95,21 90 top
FB2  54.45,29.7 180 top
IC1  13,23.8 0 top
IC2  74.25,22.5 270 top
IC3  75.25,29.5 0 top
IC4  29.85,26.1 180 bottom
IC5  30.1,23.1 0 top
IC6  29.85,26.85 0 top
J7  29.85,29.35 180 top
J8  28.35,29.35 0 top
J9  99.75,22.5 90 top
J13  71.85,22 180 top
J14  71.85,21 180 top
J15  71.6,29.5 180 top
J16  71.8,28.5 180 top
J17  77,27 270 top
JP5  48.8,32.55 180 top
L1  91.75,22.75 0 top
LED1  59.5,26.65 270 top
LED3  58.25,26.65 270 top
OPT_R1  77,23.5 90 top
Q1  97.1,30.15 180 top
R1  33.1,29.6 180 top
R2  33.6,24.85 0 top
R3  33.6,28.35 0 top
R4  26.45,28.1 90 top
R5  93.75,28.75 180 top
R6  93.75,30.5 180 top
R7  11.9,29.2 270 top
R8  13,29.2 270 top
R9  72.25,27.55 180 top
R10  57.65,17.55 90 top
R11  47.55,30.3 90 top
R12  49.55,30.3 90 top
R13  53.8,15.7 270 top
R14  14.4,28.7 0 top
R15  73.12,25 180 top
R16  71.75,23.5 270 top
R17  47.55,15.7 270 top
R18  48.55,15.7 270 top
R19  49.55,28.3 90 top
R20  74.25,20.1 180 top
R21  75.5,25 180 top
R22  74,26.5 270 top
R23  72.25,26.6 180 top
R24  26.45,26.3 270 top
R25  34.1,26.1 180 top
R26  48.55,28.3 90 top
R27  76,26.5 270 top
R28  51.8,15.7 270 top
R29  50.8,15.7 270 top
R30  47.55,28.3 90 top
R31  51.5,28 0 top
R32  75,26.5 270 top
R33  58.17,24.08 270 top
R34  59.4,24.1 270 top
SV1  7.6,24 90 top
SV2  96.75,10.5 0 top
SV4  68.75,24.5 90 top
SV6  24.3,25.1 270 top
SV7  30.6,19.1 180 top
SV10  53.45,12.5 180 top
U1  51.7,22.1 270 top

### Tracks (layer width: path | path; a pad name or v marks a point on that pad's centre or on a via)
+3V3  (via drill 0.35)  (5 unrouted)
  Top 0.152: J9.7 98.9,25.25 97.85,26.3 C15.P$1 C16.P$1 96.15,26.5 C23.+ 93.5,26.5 v93.25,26.75 v93.25,26 93.25,22.85 L1.2 | J9.16 J9.15 v102.25,21.25 v102.25,20.5 102.25,17.5 101.25,16.5 100.75,16.5 99.75,15.5 99.75,14 100.25,13.5 102.75,13.5 103.25,13 103.25,11 101.83,9.58 SV2.9 | R4.1 R24.1 26.4,26.8 | R2.2 35.35,24.85 35.84,25.34 35.84,27.75 35.24,28.35 R3.2 33.91,28.53 R1.1 33.91,29.98 v33,30.9 | C18.P$2 C1.P$2 56.3,20.05 v56.25,20 | D1.A 57.5,15.5 | 57.5,15.5 v58.75,15.5 | U1.8 55.47,17.18 55.47,16.91 56.88,15.5 57.5,15.5 | U1.7 U1.8 | U1.8 55,18.75 v56.25,20 | JP5.2 48.8,31.55 | 48.75,31.5 48.8,31.55 | 48.8,31.55 48.8,31.3 48.5,31 v48.5,30.75 | 73.25,25.62 73.62,25.25 R15.1 | 73.25,25.62 73.62,26 R22.2 R32.2 R27.2 R21.1 76.75,25.75 v77,25.75 77.58,25.17 77.58,23 | R16.1 v71.75,25.62 | v71.75,25.62 73.25,25.62 | v71.75,25.62 R23.2 R9.2 | R20.1 74.78,20.12 v75.75,20.12 75.83,20.2 77.2,20.2 77.58,20.58 77.58,23 | v72.75,29.5 72.97,29.72 IC3.3 74.31,29.72 74.61,30 IC3.23 IC3.22 | v25.5,26.4 25.9,26.8 26.4,26.8 | IC3.1 72.88,30.72 v72.8,30.8 | v56.25,20 56.25,21.75 57.3,22.8 58.8,22.8 59.4,23.4 R34.2 | IC1.13 11.64,23.04 | 11.64,23.04 11.86,22.82 12.02,22.82 12.7,22.14 12.7,20.07 12.2,19.57 C37.P$1 C39.P$1 | R7.1 C36.P$1 C38.P$1 | R7.1 R8.1 13.7,29.7 13.9,29.5 R14.1 13.9,27.9 13.5,27.5 v13.5,25.6 13.5,25.52 12.02,24.04 11.86,24.04 IC1.14 11.64,23.78 11.64,23.04 | R7.1 v11.9,30.9 | IC2.7 75.7,22.95 C43.P$2 OPT_R1.1 77.58,23 | IC6.3 26.67,26.53 26.4,26.8
  Bottom 0.152: 102,21 v102.25,21.25 | v102.25,21.25 102.5,21.25 | v102.25,21.25 102.25,24.5 100.75,26 v93.25,26 | v58.75,15.5 57.75,14.5 55.83,14.5 54.5,14.5 53.5,13.5 53.5,12.55 SV10.3 | v48.5,30.75 48.5,26.5 55,20 v56.25,20 | 71.88,25.75 v71.75,25.62 71.95,25.83 71.95,31.05 71.7,31.3 70.47,31.3 SV4.5 | 72,29.5 v72.75,29.5 72.75,30.75 v72.8,30.8 76.5,30.8 77,30.3 v77,25.75 | 33,30.8 v33,30.9 33,31.1 32.4,31.7 27.2,31.7 26.5,31 26.5,27.4 v25.5,26.4 25.7,26.4 26.1,26 26.1,24.36 SV6.3 | SV1.1 9.52,18.92 v12.7,22.1
ANT_VCC
  Top 0.152: R31.2 52.1,28.1 C2.1 FB2.2
APDS_I2C_INT  (via drill 0.35)
  Top 0.152: R14.2 15,28.6 v15,27.7 15,26.3 14.72,26.02 IC1.2
  Bottom 0.152: SV1.4 13.84,26.54 v15,27.7
BACKUP  (via drill 0.35)  (1 unrouted)
  Top 0.152: U1.6 C17.P$2 R13.1 55.55,16.2 56,15.75 SV10.2 | IC2.6 75.7,22.05 C40.P$2 v76.97,22 | SV4.2 69.71,21 70.38,21 71.38,20 v72.75,20
  Bottom 0.152: SV4.2 68.79,22 | v72.75,20 74.75,22 v76.97,22
C1
  Top 0.152: C19.P$2 74.17,31.58 IC3.24
CAP
  Top 0.152: C20.P$2 75.47,31.53 IC3.21
CS_A/G
  Top 0.152: R32.1 74.17,27.83 IC3.7
CS_M
  Top 0.152: R27.1 75.38,27.62 74.88,27.62 74.61,27.89 IC3.8
D0/RST  (via drill 0.35)
  Top 0.152: J9.10 97.25,23.75 v97.1,23.9 96.9,24.1 v96.35,24.1
  Bottom 0.152: SV2.8 99.29,21.71 v97.1,23.9
D1/CS  (via drill 0.35)
  Top 0.152: J9.12 96.5,22.75 v96.5,22.6 95.45,22.6 v95.35,22.5
  Bottom 0.152: SV2.4 94.11,11.87 94.11,18.1 93.55,18.66 93.55,21.9 94.15,22.5 v95.35,22.5
D2/BUSY  (via drill 0.35)
  Top 0.152: v94.75,24.75 v95.5,24.75 97.46,24.75 97.96,24.25 J9.9
  Bottom 0.152: SV2.10 101.83,18.42 99.8,20.45 99.8,22.06 97.15,24.71 95.54,24.71 v95.5,24.75
D3/DC  (via drill 0.35)
  Top 0.152: J9.11 95.85,23.25 v95.75,23.35
  Bottom 0.152: SV2.6 98.48,13.5 98.75,13.5 98.75,21.21 96.75,23.21 95.89,23.21 v95.75,23.35 94.75,23.35 v94.65,23.25
EXT_SCL  (via drill 0.35)  (2 unrouted)
  Top 0.152: SV7.2 30.33,19.37 30.33,25.6 30.63,25.9 30.63,27.92 29.52,29.03 J7.P$2 | 69.41,24.5 69.41,24.11 | J13.P$2 71.06,22.47 71.06,23.5 70.06,24.5 69.41,24.5 | v70.75,27.75 70.75,26.5 SV4.3 69.41,24.5 | v71.25,30.5 71.27,30.48 J15.P$2 | R8.2 13,27 12.02,26.02 IC1.17 11.47,26.02 9.8,24.36 9.8,23.66 SV1.2
  Bottom 0.152: v70.75,27.75 70.75,30 v71.25,30.5
EXT_SDA  (via drill 0.35)  (3 unrouted)
  Top 0.152: J8.P$2 28.79,29.24 28.79,29 30.25,27.55 30.25,25.95 29.95,25.65 29.95,20.99 SV7.3 | J16.P$2 70.21,28.5 SV4.4 | v70.25,23.25 70.75,22.75 70.75,21.77 J14.P$2 | R7.2 11.62,28.42 IC1.18 11.39,26.52 11.23,26.52 8.7,24 8.26,24
  Bottom 0.152: v70.25,23.25 71,24 71,26 69.96,27.04 SV4.4
EXT_UART_RX  (via drill 0.35)  (1 unrouted)
  Top 0.152: D12.1 60,20.45 v60,19
  Bottom 0.152: SV10.4 56.66,18.25 59.25,18.25 v60,19
EXT_UART_TX  (via drill 0.35)  (1 unrouted)
  Top 0.152: v58.75,19.5 58.85,19.6 D11.1
  Bottom 0.152: SV10.5 55.12,19.25 58.5,19.25 v58.75,19.5
EXTINT_LV
  Top 0.152: U1.5 51.7,16.3 R28.1
GDR
  Top 0.152: R6.1 94.8,30.78 Q1.1 96.28,30.78 97.61,29.45 98.1,29.45 98.75,28.8 98.75,28 99,27.75 J9.2
GND  (via drill 0.35, 1)  (7 unrouted)
  Top 0.152: C47.P$1 34.9,27.35 v35,27.25 35,26.19 R25.1 | C2.2 51.1,30.03 | C43.P$1 OPT_R1.2 | IC3.14 IC3.15 IC3.16 IC3.17 76.72,30.69 IC3.18 | IC2.5 75.85,21.15 C40.P$1 v76.97,21 77.22,21 | SV7.1 33.14,20.64 34.1,21.6 C48.P$1 C4.P$1 | C5.P$1 C46.P$1 28.75,23 IC5.2 | 56.25,31.12 56.25,30.35 v56.3,30.3 56.3,29.4 v56.1,29.2 v56.1,28 U1.10 56.12,26.53 v56.12,25.12 v55,25.12 v54,25.12 54,26.45 U1.12 53.95,26.6 D10.2 53.95,28.75 v53.9,28.8 | ANT1.1 53.37,31.51 54,30.88 | C3.P$1 v28.6,30.6 | v52.9,27.8 v52.9,28.8 52.9,28.9 | C20.P$1 76.25,30.8 IC3.19 | C8.P$2 C7.P$2 | C7.P$2 96.75,20.25 C6.P$2 | v96.5,15.75 C12.P$1 C9.P$2 | C7.P$2 96,20 v95.75,20.25 | v96.75,13.75 97,13.75 C10.P$2 C11.P$2 | C16.P$2 C15.P$2 98,25.3 98.55,24.75 J9.8 | C31.P$1 C33.P$1 | SV1.5 8.92,29.08 9.4,28.6 10,28.6 C38.P$2 C36.P$2 | C34.P$1 v14,16.6 | IC6.2 28.83,27.17 29.3,26.7
  other vias: 52.9,30.4 4.7,4.7 23,40 25.5,30.75 25.5,32.75 27.5,32.75 27.5,30.75 29.5,32.75 31.75,32.75 34,32.75 34,31 35.5,29.75 35,20.75 27.25,21.25 26.5,22 35,22.25 35,23.75 47.25,24.75 47.25,22.25 49.75,22.25 47.25,19.5 49.75,19.5 46,30.75 46,29.25 51.5,32.75 51.5,31.25 52.25,19.5 46.25,15.75 60,14.5 60,16 60,17.5 58.75,17.5 58.75,32.75 59,28.75 57.75,28.75 75.75,30 75.75,29 70.75,33 72.25,33 73.5,33 75,33 76.25,33 101,17.75 102.75,16.75 103.05,18.75 101.4,19.9 101.25,23.25 102,26 88.75,20.25 88.75,23.25 88.75,25.75 88.75,17.75 88.75,14.5 93,13.75 91.25,28.75 90,28 91.25,30.5 102,32 102,28 104.25,8.75 104.25,10.75 89.5,9.5 76.9,24.75 98.25,25 95.5,28.1 11.5,16.7 10.6,21 9.6,25.8 13.4,19.9 10.6,23.8 13.2,23.8 13.5,30.8 10.8,30.6 29.6,27.3
  pour Top: -1.35,44 -1.35,2.9 3.85,-2.3 108.95,-2.3 110,-1.25 110,36.2 111.75,37.95 111.75,42.85 110.6,44
  pour Bottom: -0.75,43 -0.75,-2.2 -0.65,-2.3 108.95,-2.3 110,-1.25 110,36.2 111.75,37.95 111.75,42.85 110.35,44.25 0.5,44.25
  pour Bottom: 6.9,12.3 14.4,12.3 16.4,14.3 16.4,32.9 14.2,35.1 7.5,35.1 5.4,33 5.4,13.8
  pour Top: 5.8,11.9 14.7,11.9 17,14.2 17,33 14.2,35.8 7.6,35.8 5,33.2 5,12.7
GPS_RF
  Top 0.152: D10.1 55,27.85 U1.11 | FB2.1 54.95,30.47 ANT1.3
  Top 0.889: ANT1.3 55,30.52 U1.11
INT_M
  Top 0.152: J17.P$1 76.58,27.75 75.75,27.75 75.47,28.03 IC3.10
MOSI  (via drill 0.35)  (1 unrouted)
  Top 0.152: 100,21.75 97.25,21.75 96.5,21 95,21 v94.75,20.75
  Bottom 0.152: v94.75,20.75 94.75,18.75 95.75,17.75 95.75,9.77 96.52,9 SV2.5
N$1
  Top 0.152: IC5.1 27.5,24.05 C46.P$2 C5.P$2
N$2  (via drill 0.35)
  Top 0.152: R2.1 32.08,25.88 IC6.5 31.8,25.62 32.1,25.33 v32.1,25.1
  Bottom 0.152: IC4.2 29.3,24.5 29.7,24.1 29.7,23.4 30.2,22.9 31.6,22.9 32.1,23.4 v32.1,25.1
N$3  (via drill 0.35)
  Top 0.152: R24.2 26.62,25.62 27.65,25.62 27.8,25.78 | 27.8,25.78 IC6.4 | v27.8,25 27.8,25.78
  Bottom 0.152: v27.8,25 28.1,25.3 IC4.3
N$4
  Top 0.152: IC1.10 11.62,20.82 C31.P$2
N$5
  Top 0.152: IC6.8 32.58,27.83 R3.1 31.18,28.35 J7.P$1
N$6
  Top 0.152: IC6.1 27.9,28.6 | 27.9,28.6 27.9,29.23 J8.P$1 | R4.2 27.9,28.6
N$7
  Top 0.152: LED3.A 58.25,24.65 R33.1
N$8
  Top 0.152: IC1.11 11.92,21.58 12.2,21.3 12.2,20.4 11.3,19.5 C32.P$2
N$9
  Top 0.152: IC1.12 10.32,22.32 C33.P$2
N$10
  Top 0.152: IC1.9 14.9,20.32 C35.P$2 C34.P$2
N$12
  Top 0.152: R34.1 59.4,25.8 LED1.A
N$14
  Top 0.152: R20.2 73.75,21.05 IC2.4 73.5,21 J14.P$1
N$15  (via drill 0.35)
  Top 0.152: C3.P$2 31.28,30.6 R1.2 v31.2,29.6
  Bottom 0.152: IC4.10 IC4.9 31.6,27.7 31.8,27.9 31.8,29.4 31.6,29.6 v31.2,29.6
N$16
  Top 0.152: IC2.3 72.23,22.05 J13.P$1 72.18,22.57 R16.2
N$17
  Top 0.152: IC2.2 73.6,23 73,23 72.62,23.38 R15.2
N$19
  Top 0.152: R12.2 49.55,32.49 JP5.1
N$20
  Top 0.152: R11.2 48,31.25 48,32.54 JP5.3
N$21
  Top 0.152: R13.2 54.05,15.45 D1.C
N$23
  Top 0.152: C6.P$1 98.41,20.92 98.41,20 98.66,19.75 J9.18
N$26
  Top 0.152: J9.19 98.5,19.25 C7.P$1
N$27
  Top 0.152: J9.20 98,18.75 C8.P$1
N$44
  Top 0.152: IC6.6 32.86,26.53 R25.2
N$45
  Top 0.152: IC2.8 74.85,24.85 R21.2
N$46
  Top 0.152: 96.53,18.28 96.5,18.25 C12.P$2 | J9.21 99.72,18.28 96.53,18.28 | D2.- 95.25,19.25 96.22,18.28 96.53,18.28
N$47
  Top 0.152: J9.22 C9.P$1
N$48
  Top 0.152: D3.+ 95.3,14.5 96.75,14.5 C10.P$1 97.75,16.03 98.28,16.03 98.5,16.25 98.5,16.75 99,17.25 J9.23
N$49
  Top 0.152: C49.1 93,17.1 D4.+
  Top 0.254: D3.- 94.75,17.45 D4.+
N$50  (via drill 0.35)
  Top 0.152: Q1.3 99.1,30.15 99.25,30 v99,30 99.3,29.7 v99.3,29.25 | L1.1 91.75,21.15 91.75,20.3 D2.+ 91.85,19.25 C49.2 90.75,17 v91,16.75 v91.75,16.75
  Bottom 0.152: v99.3,29.25 94,29.25 91.75,27 v91.75,16.75
N$51
  Top 0.152: C13.P$1 97.45,28.3 99,26.75 J9.4
N$64  (via drill 0.35)
  other vias: 71.25,19.25
PPS  (via drill 0.35)
  Top 0.152: R33.2 56.67,23.58 56.65,23.55 53.5,20.4 v53.5,19.5 | v49.75,15.25 50.75,15.25 R29.2
  Bottom 0.152: v53.5,19.5 53.5,19 v49.75,15.25
PPS_LV
  Top 0.152: R29.1 50.6,16.4 U1.4
RESE
  Top 0.152: R5.1 95.28,29.52 Q1.2 97.01,29.52 97.51,29.02 97.81,29.02 98.38,28.44 98.38,27.9 99.03,27.25 J9.3
RST_LV
  Top 0.152: R10.1 56.7,17.05 U1.9
RXLV
  Top 0.152: R18.1 49.3,16.95 49.3,17.45 U1.3
SAFE_LV
  Top 0.152: U1.18 47.3,27.55 R30.1
SCK  (via drill 0.35)
  Top 0.152: v94.65,21.75 v96,21.75 96.61,21.75 97.11,22.25 J9.13
  Bottom 0.152: v94.65,21.75 94.5,21.75 93.95,21.2 93.95,18.8 95.25,17.5 95.25,9.8 94.68,9.23 SV2.3
SCL
  Top 0.152: R26.2 R11.1
SCL_3V
  Top 0.152: IC3.2 72.47,30.14 71.93,29.6 J15.P$1
SCL_LV
  Top 0.152: U1.17 48.4,27.65 R26.1
SDA
  Top 0.152: R19.2 R12.1
SDA_LV
  Top 0.152: R19.1 49.5,27.75 U1.16
SDO_AG
  Top 0.152: IC3.5 73.56,28.86 73.35,28.65 73.35,27.15 72.8,26.6 R23.1
SDO_M
  Top 0.152: IC3.6 73.75,27.25 R22.1
SDO_M1
  Top 0.152: IC3.4 73.51,29.28 72.52,28.28 | J16.P$1 72.13,28.55 72.19,28.61 72.52,28.28 | R9.1 72.75,28.05 72.52,28.28
TXLV
  Top 0.152: R17.1 47.55,16.3 48.4,17.15 U1.2
V+1V8  (via drill 0.35)
  Top 0.152: C47.P$2 32.92,27.17 IC6.7 31.17,27.17 30.95,26.95 30.95,24.05 IC5.5 32.9,24.05 C4.P$2 C48.P$2 33.1,22.4 v32.6,21.9 | v26.8,24.9 24.5,24.9 SV6.2
  Bottom 0.152: IC4.11 32.3,26.1 33,25.4 33,23.9 32.6,23.5 v32.6,21.9 28.5,21.9 26.8,23.6 v26.8,24.9
VCC_RF
  Top 0.152: R31.1 51.7,27.3 U1.14
VCOM
  Top 0.152: J9.24 99.75,16.5 C11.P$1
VGH
  Top 0.152: J9.5 98.8,26.25 97.75,27.3 C14.P$1

### Text on the board
tNames: TX / D1 / D3 / D0 / D2 | GND / 1V8 / 3V3 | SDA / SCL / GND | 3V3 / SDA / SC: / BACKUP / GND | TX / RX / 3V3 / BACKUP / GND | RX / SCK / MOSI / GND / 3V3